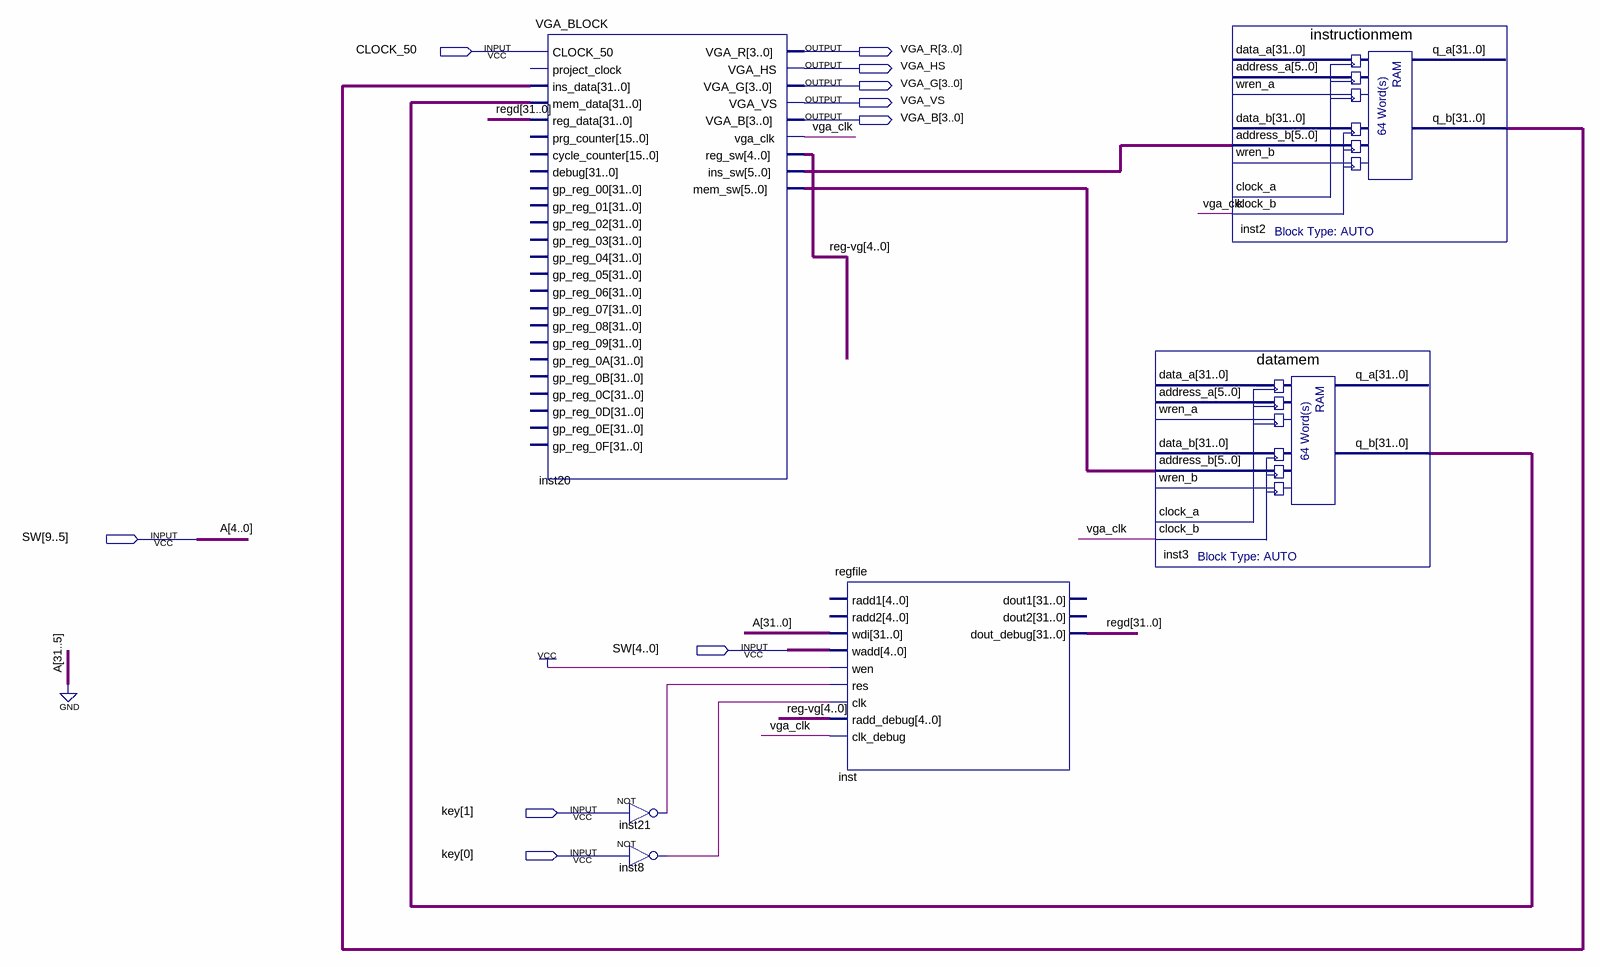
[diagram p0: schematic sheet]
// Quartus schematic Lab_5.bdf as structural Verilog: 6 symbols, 10 pins
module Lab_5 (
  input  CLOCK_50,
  input  [9:0] SW,
  input  [1:0] key,
  output [3:0] VGA_R,
  output VGA_HS,
  output [3:0] VGA_G,
  output VGA_VS,
  output [3:0] VGA_B
);

  wire inst8_out, inst21_out, vga_clk;
  wire [4:0] \reg-vg ;
  wire [5:0] inst20_ins_sw, inst20_mem_sw;
  wire [31:0] inst2_q_b, inst3_q_b, regd;

  VGA_BLOCK inst20 (
    .CLOCK_50(CLOCK_50), .ins_data(inst2_q_b), .mem_data(inst3_q_b), .reg_data(regd), .VGA_R(VGA_R),
    .VGA_HS(VGA_HS), .VGA_G(VGA_G), .VGA_VS(VGA_VS), .VGA_B(VGA_B), .vga_clk(vga_clk), .reg_sw(\reg-vg ),
    .ins_sw(inst20_ins_sw), .mem_sw(inst20_mem_sw));  // open: project_clock, prg_counter, cycle_counter, debug, gp_reg_00, gp_reg_01, gp_reg_02, gp_reg_03, gp_reg_04, gp_reg_05, gp_reg_06, gp_reg_07, gp_reg_08, gp_reg_09, gp_reg_0A, gp_reg_0B, gp_reg_0C, gp_reg_0D, gp_reg_0E, gp_reg_0F
  not inst21 (inst21_out, key[1]);
  not inst8 (inst8_out, key[0]);
  regfile inst (
    .wdi({{27{1'b0}}, SW[9:5]}), .wadd(SW[4:0]), .wen(1'b1), .res(inst21_out), .clk(inst8_out),
    .radd_debug(\reg-vg ), .clk_debug(vga_clk), .dout_debug(regd));  // open: radd1, radd2, dout1, dout2
  datamem inst3 (
    .address_b(inst20_mem_sw), .clock_b(vga_clk), .q_b(inst3_q_b));  // open: data_a, address_a, wren_a, data_b, wren_b, clock_a, q_a
  instructionmem inst2 (
    .address_b(inst20_ins_sw), .clock_b(vga_clk), .q_b(inst2_q_b));  // open: data_a, address_a, wren_a, data_b, wren_b, clock_a, q_a

  // Other names for the same wires on the sheet: A[4:0] = SW[9:5]
endmodule
